# Altium schematic sheet placa1.SchDoc
size A
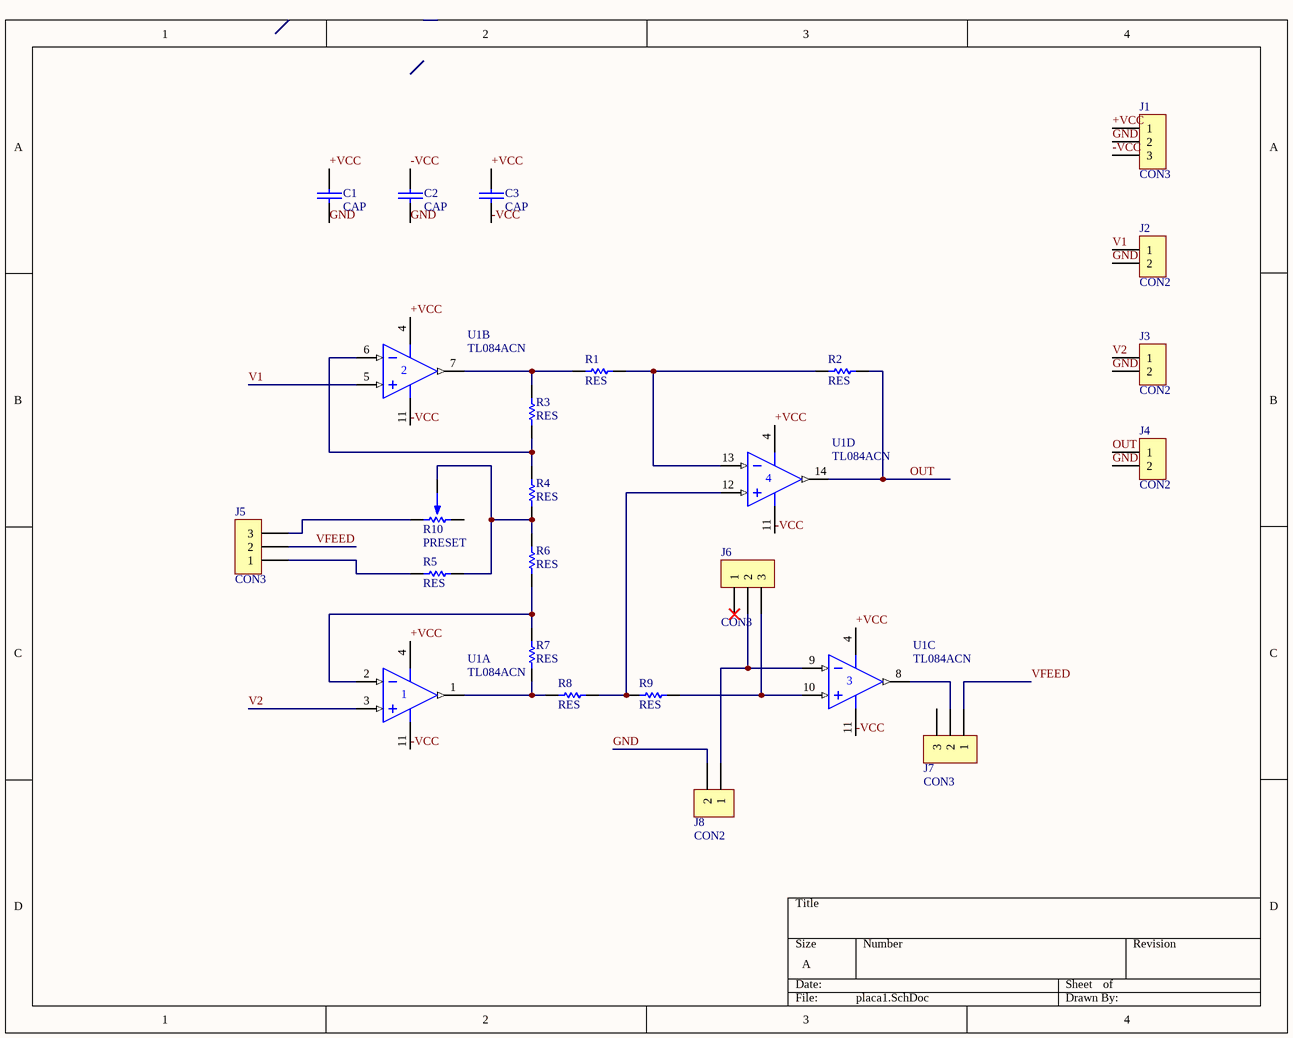
[diagram p0: placa1.SchDoc]

## Parts
C1  CAP  [CAP200]
C2  CAP  [CAP200]
C3  CAP  [CAP200]
J1  CON3  [SIP3]
J2  CON2  [SIP2]
J3  CON2  [SIP2]
J4  CON2  [SIP2]
J5  CON3  [SIP3]
J6  CON3  [SIP3]
J7  CON3  [SIP3]
J8  CON2  [SIP2]
R1  RES  [0805]
R2  RES  [0805]
R3  RES  [0805]
R4  RES  [0805]
R5  RES  [0805]
R6  RES  [0805]
R7  RES  [0805]
R8  RES  [0805]
R9  RES  [0805]
R10  PRESET  [PRESET V]
U1  TL084ACN  [646-06]  (parts A,B,C,D of 4)

## Nets
+VCC: C1.1 C3.1 J1.1 U1.4(V+)
-VCC: C2.1 C3.2 J1.3 U1.11(V-)
GND: C1.2 C2.2 J1.2 J2.2 J3.2 J4.2 J8.2
OUT: J4.1 R2.2 U1.14(OUT)
V1: J2.1 U1.5(IN+)
V2: J3.1 U1.3(IN+)
VFEED: J5.2 J7.1
NetJ5_1: J5.1 R5.1
NetJ5_3: J5.3 R10.1
NetJ6_2: J6.2 J8.1 U1.9(IN-)
NetJ6_3: J6.3 R9.2 U1.10(IN+)
NetJ7_2: J7.2 U1.8(OUT)
NetR1_1: R1.1 R3.2 U1.7(OUT)
NetR1_2: R1.2 R2.1 U1.13(IN-)
NetR3_1: R3.1 R4.2 U1.6(IN-)
NetR4_1: R4.1 R5.2 R6.2 R10.2
NetR6_1: R6.1 R7.2 U1.2(IN-)
NetR7_1: R7.1 R8.1 U1.1(OUT)
NetR8_2: R8.2 R9.1 U1.12(IN+)

Not connected (* = marked no-connect by the designer): J6 1*; J7 3; R10 3

## Library data of the parts
U1 = TL084ACN: JFET-Input Operational Amplifier; Published: 17-Jul-2002; LatestRevisionDate: 06-Jun-2005; LatestRevisionNote: Stylized 3D Model Added.; DatasheetVersion: 1988; PackageVersion: 1997; PackageReference: 646-06; Publisher: Altium Limited; PackageDescription: DIP; 14 Leads; Row Spacing 7.62 mm; Pitch 2.54 mm; ComponentLink1Description: Manufacturer Link; ComponentLink1URL: http://www.onsemi.com/site/products/parametrics/0,4446,251,00.html